# EAGLE schematic Wheel_Encoder_Adapter_Schmitt (EAGLE 5.11)
BOM: EXCLUDE; PARTNO: ERJ-6ENF1002V
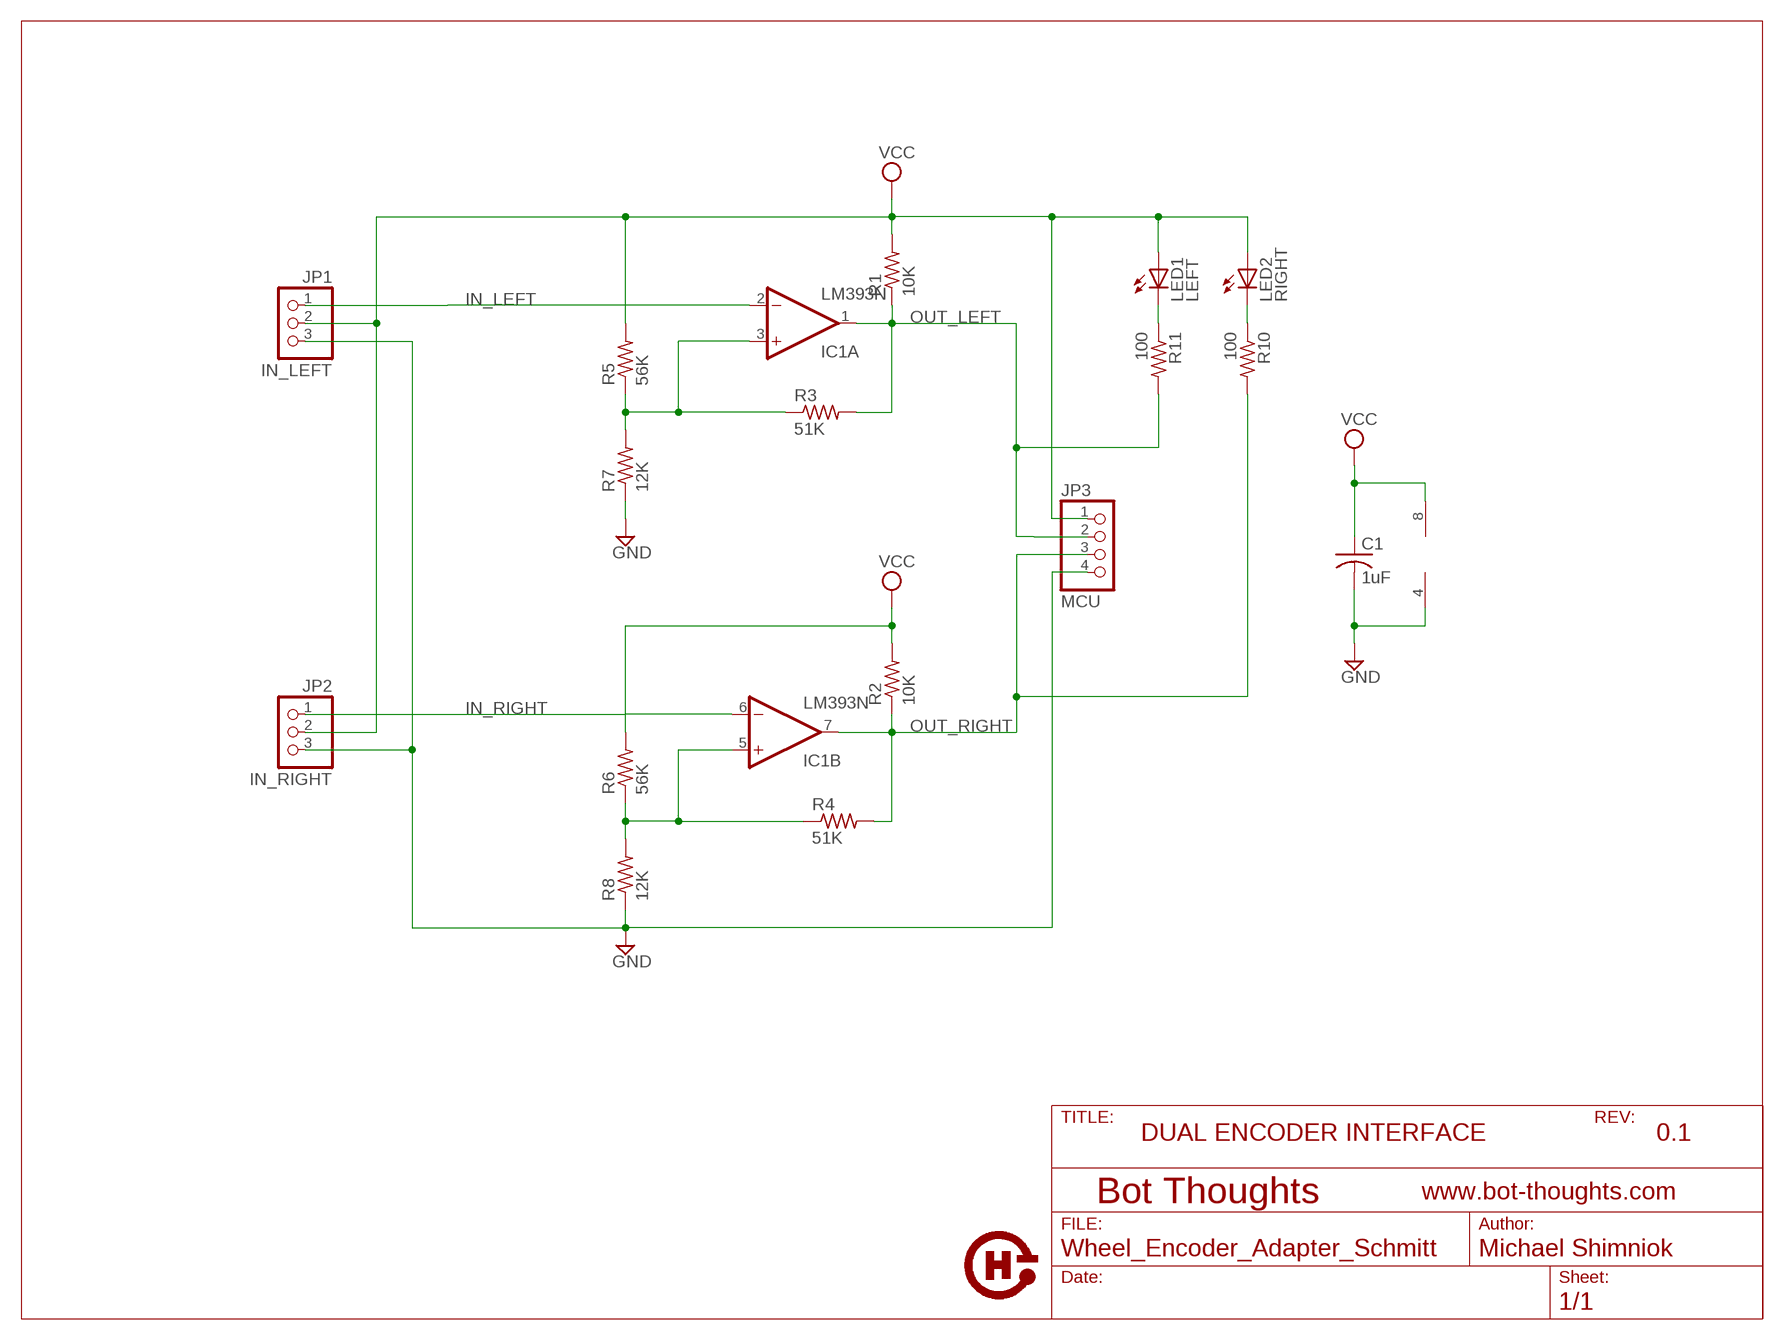
[diagram p0: schematic, sheet 1]

## Parts
C1  1uF  C-USC0805  [C0805]
IC1  LM393N  [DIL08]
JP1  IN_LEFT  PINHD-1X03_2.54-S  [1X03-S]
JP2  IN_RIGHT  PINHD-1X03_2.54-S  [1X03-S]
JP3  MCU  PINHD-1X04_2.54-S  [1X04-S]
LED1  LEFT  LED3MM  [LED3MM]
LED2  RIGHT  LED3MM  [LED3MM]
R1  10K  R-US_0204/2V  [0204V]
R2  10K  R-US_0204/2V  [0204V]
R3  51K  R-US_0204/5  [0204/5]
R4  51K  R-US_0204/5  [0204/5]
R5  56K  R-US_0204/5  [0204/5]
R6  56K  R-US_0204/5  [0204/5]
R7  12K  R-US_0204/5  [0204/5]
R8  12K  R-US_0204/5  [0204/5]
R10  100  R-US_0204/2V  [0204V]
R11  100  R-US_0204/2V  [0204V]
U$2  OSHW-LOGO  [OSHW-LOGO]

## Nets
GND: C1.2 IC1.4(P:V-) JP1.3 JP2.3 JP3.4 R7.1 R8.1
IN_LEFT: IC1.2(A:-IN) JP1.1
IN_RIGHT: IC1.6(B:-IN) JP2.1
N$1: LED1.K(C) R11.1
N$2: IC1.3(A:+IN) R3.1 R5.1 R7.2
N$3: LED2.K(C) R10.1
N$7: IC1.5(B:+IN) R4.1 R6.1 R8.2
OUT_LEFT: IC1.1(A:OUT) JP3.2 R1.1 R3.2 R11.2
OUT_RIGHT: IC1.7(B:OUT) JP3.3 R2.1 R4.2 R10.2
VCC: C1.1 IC1.8(P:V+) JP1.2 JP2.2 JP3.1 LED1.A LED2.A R1.2 R2.2 R5.2 R6.2

## Notes on the sheet
- DUAL ENCODER INTERFACE | 0.1

## Library data of the parts
C1 = rcl:C-US: CAPACITOR, American symbol
IC1 = linear:LM393: COMPARATOR
JP1 JP2 = pinhead-2:PINHD-1X03: PIN HEADER
JP3 = pinhead-2:PINHD-1X04: PIN HEADER
LED1 LED2 = led:LED: LED OSRAM: - CHIPLED LG R971, LG N971, LY N971, LG Q971, LY Q971, LO R971, LY R971 LH N974, LH R974 LS Q976, LO Q976, LY Q976 LO Q996 - Hyper CHIPLED LW Q18S LB Q993, LB Q99A, LB R99A - SideLED LS A670, LO A670, LY A670, LG A670, LP A670 LB A673, LV A673, LT A673, LW A673 LH A674 LY A675 LS A676, LA A676, LO A676, LY A676, LW A676 LS A679, LY A679, LG A679 - Hyper Micro SIDELED® LS Y876, LA Y876, LO Y876, LY Y876 LT Y87S - SmartLED LW L88C, LW L88S LB L89C, LB L89S, LG L890 LS L89K, LO L89K, LY L89K LS L896, LA L896, LO L896, LY L896 - TOPLED LS T670, LO T670, LY T670, LG T670, LP T670 LSG T670, LSP T670, LSY T670, LOP T670, LYG T670 LG T671, LOG T671, LSG T671 LB T673, LV T673, LT T673, LW T673 LH T674 LS T676, LA T676, LO T676, LY T676, LB T676, LH T676, LSB T676, LW T676 LB T67C, LV T67C, LT T67C, LS T67K, LO T67K, LY T67K, LW E67C LS E67B, LA E67B, LO E67B, LY E67B, LB E67C, LV E67C, LT E67C LW T67C LS T679, LY T679, LG T679 LS T770, LO T770, LY T770, LG T770, LP T770 LB T773, LV T773, LT T773, LW T773 LH T774 LS E675, LA E675, LY E675, LS T675 LS T776, LA T776, LO T776, LY T776, LB T776 LHGB T686 LT T68C, LB T68C - Hyper Mini TOPLED® LB M676 - Mini TOPLED Santana® LG M470 LS M47K, LO M47K, LY M47K Source: http://www.osram.convergy.de LUXEON: - LUMILED® LXK2-PW12-R00, LXK2-PW12-S00, LXK2-PW14-U00, LXK2-PW14-V00 LXK2-PM12-R00, LXK2-PM12-S00, LXK2-PM14-U00 LXK2-PE12-Q00, LXK2-PE12-R00, LXK2-PE12-S00, LXK2-PE14-T00, LXK2-PE14-U00 LXK2-PB12-K00, LXK2-PB12-L00, LXK2-PB12-M00, LXK2-PB14-N00, LXK2-PB14-P00, LXK2-PB14-Q00 LXK2-PR12-L00, LXK2-PR12-M00, LXK2-PR14-Q00, LXK2-PR14-R00 LXK2-PD12-Q00, LXK2-PD12-R00, LXK2-PD12-S00 LXK2-PH12-R00, LXK2-PH12-S00 LXK2-PL12-P00, LXK2-PL12-Q00, LXK2-PL12-R00 Source: www.luxeon.com KINGBRIGHT: KA-3528ASYC Source: www.kingbright.com
R1-R8 R10 R11 = resistor:R-US_: RESISTOR, American symbol
U$2 = SparkFun:OSHW-LOGO: Open Source Hardware Logo This logo indicates the piece of hardware it is found on incorporates a OSHW license and/or adheres to the definition of open source hardware found here: http://freedomdefined.org/OSHW